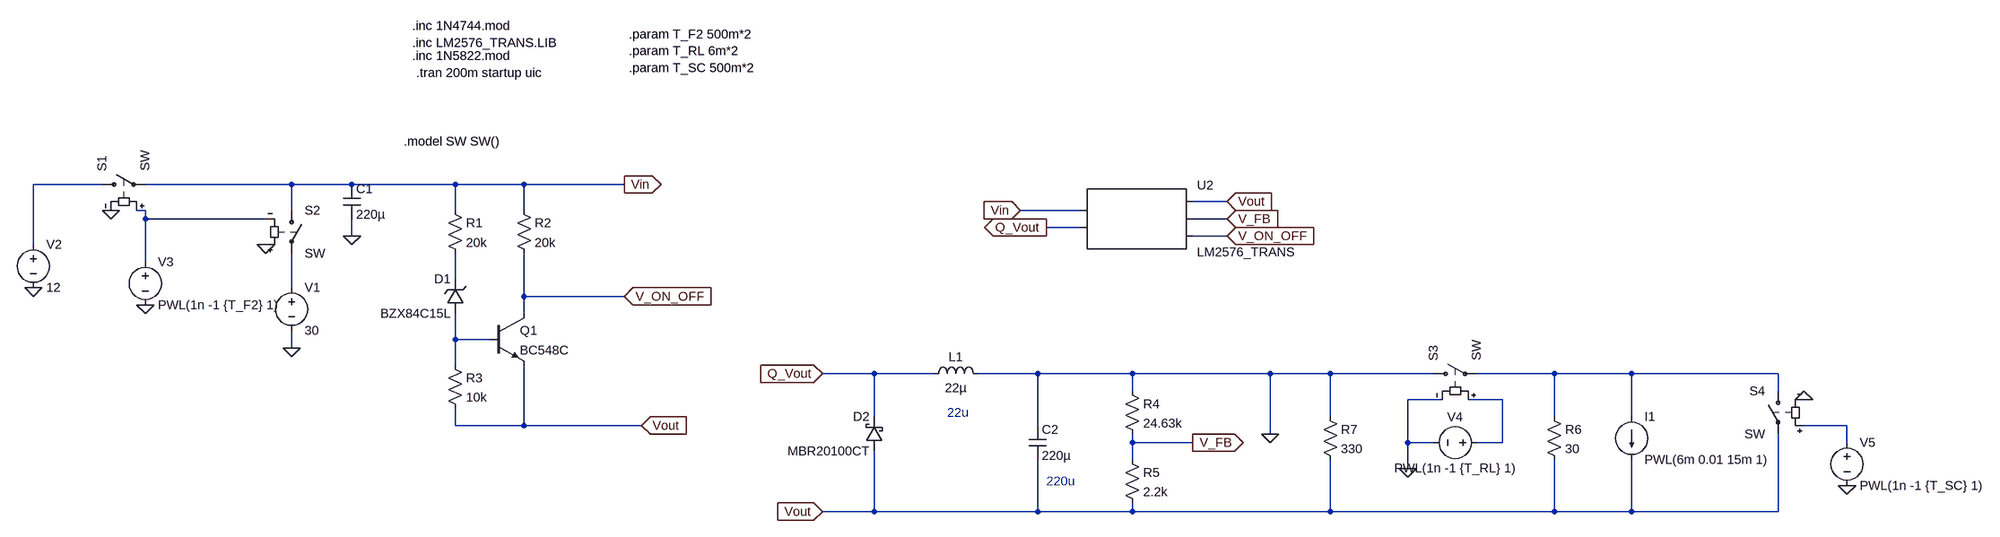
[diagram p0: schematic inverter_stepdown_LM2576.asc]
inverter_stepdown_LM2576.asc, the LTspice schematic file:
Version 4
SHEET 1 1792 680
WIRE -1760 -320 -1888 -320
WIRE -1408 -320 -1680 -320
WIRE -1296 -320 -1408 -320
WIRE -1104 -320 -1296 -320
WIRE -976 -320 -1104 -320
WIRE -768 -320 -976 -320
WIRE 352 -288 288 -288
WIRE -1680 -272 -1696 -272
WIRE -1408 -272 -1408 -320
WIRE -1104 -272 -1104 -320
WIRE -976 -272 -976 -320
WIRE 80 -272 -32 -272
WIRE -1680 -256 -1680 -272
WIRE -1456 -256 -1680 -256
WIRE 352 -256 288 -256
WIRE 80 -240 16 -240
WIRE -1296 -224 -1296 -256
WIRE 352 -224 288 -224
WIRE -1888 -208 -1888 -320
WIRE -1680 -176 -1680 -256
WIRE -1104 -144 -1104 -192
WIRE -1408 -128 -1408 -192
WIRE -976 -112 -976 -192
WIRE -768 -112 -976 -112
WIRE -976 -80 -976 -112
WIRE -1104 -32 -1104 -80
WIRE -1040 -32 -1104 -32
WIRE -1408 -16 -1408 -48
WIRE -1104 16 -1104 -32
WIRE -304 32 -400 32
WIRE -192 32 -304 32
WIRE 0 32 -112 32
WIRE 176 32 0 32
WIRE 432 32 176 32
WIRE 544 32 432 32
WIRE 736 32 544 32
WIRE 960 32 816 32
WIRE 1104 32 960 32
WIRE 1376 32 1104 32
WIRE 176 64 176 32
WIRE 1376 64 1376 32
WIRE 752 80 688 80
WIRE 864 80 800 80
WIRE -304 112 -304 32
WIRE 544 112 544 32
WIRE 960 112 960 32
WIRE 1104 112 1104 32
WIRE -1104 128 -1104 96
WIRE -976 128 -976 16
WIRE -976 128 -1104 128
WIRE -736 128 -976 128
WIRE 0 128 0 32
WIRE 1504 128 1424 128
WIRE 432 144 432 32
WIRE 176 160 176 144
WIRE 288 160 176 160
WIRE 688 160 688 80
WIRE 736 160 688 160
WIRE 864 160 864 80
WIRE 864 160 816 160
WIRE 1504 160 1504 128
WIRE 176 192 176 160
WIRE 688 208 688 160
WIRE -304 288 -304 176
WIRE -304 288 -400 288
WIRE 0 288 0 192
WIRE 0 288 -304 288
WIRE 176 288 176 272
WIRE 176 288 0 288
WIRE 544 288 544 192
WIRE 544 288 176 288
WIRE 960 288 960 192
WIRE 960 288 544 288
WIRE 1104 288 1104 192
WIRE 1104 288 960 288
WIRE 1376 288 1376 144
WIRE 1376 288 1104 288
FLAG -1408 -16 0
FLAG -768 -320 Vin
IOPIN -768 -320 Out
FLAG -1296 -224 0
FLAG -768 -112 V_ON_OFF
IOPIN -768 -112 In
FLAG -1888 -128 0
FLAG -1680 -96 0
FLAG -1744 -272 0
FLAG -1456 -208 0
FLAG -32 -272 Vin
IOPIN -32 -272 In
FLAG 16 -240 Q_Vout
IOPIN 16 -240 Out
FLAG 352 -256 V_FB
IOPIN 352 -256 In
FLAG 352 -224 V_ON_OFF
IOPIN 352 -224 In
FLAG -400 32 Q_Vout
IOPIN -400 32 In
FLAG 288 160 V_FB
IOPIN 288 160 Out
FLAG 688 208 0
FLAG 1504 240 0
FLAG 1424 80 0
FLAG -736 128 Vout
IOPIN -736 128 In
FLAG 352 -288 Vout
IOPIN 352 -288 In
FLAG -400 288 Vout
IOPIN -400 288 In
FLAG 432 144 0
SYMBOL voltage -1408 -144 R0
SYMATTR InstName V1
SYMATTR Value 30
SYMBOL cap -1312 -320 R0
SYMATTR InstName C1
SYMATTR Value 220µ
SYMBOL res -1120 -288 R0
SYMATTR InstName R1
SYMATTR Value 20k
SYMBOL res -992 -288 R0
SYMATTR InstName R2
SYMATTR Value 20k
SYMBOL res -1120 0 R0
SYMATTR InstName R3
SYMATTR Value 10k
SYMBOL npn -1040 -80 R0
SYMATTR InstName Q1
SYMATTR Value BC548C
SYMBOL zener -1088 -80 R180
WINDOW 0 24 64 Left 2
WINDOW 3 24 0 Left 2
SYMATTR InstName D1
SYMATTR Value BZX84C15L
SYMBOL sw -1776 -320 R270
SYMATTR InstName S1
SYMBOL sw -1408 -288 R0
SYMATTR InstName S2
SYMBOL voltage -1888 -224 R0
SYMATTR InstName V2
SYMATTR Value 12
SYMBOL voltage -1680 -192 R0
WINDOW 123 0 0 Left 2
WINDOW 39 0 0 Left 2
SYMATTR InstName V3
SYMATTR Value PWL(1n -1 {T_F2} 1)
SYMBOL AutoGenerated\\LM2576_TRANS 176 -256 R0
SYMATTR InstName U2
SYMBOL ind -208 48 R270
WINDOW 0 32 56 VTop 2
WINDOW 3 5 56 VBottom 2
SYMATTR InstName L1
SYMATTR Value 22µ
SYMATTR SpiceLine Ipk=10.1 Rser=0.02752 Cpar=0
SYMBOL cap -16 128 R0
SYMATTR InstName C2
SYMATTR Value 220µ
SYMBOL res 160 48 R0
SYMATTR InstName R4
SYMATTR Value 24.63k
SYMBOL res 160 176 R0
SYMATTR InstName R5
SYMATTR Value 2.2k
SYMBOL res 944 96 R0
SYMATTR InstName R6
SYMATTR Value 30
SYMBOL schottky -288 176 R180
WINDOW 0 24 64 Left 2
WINDOW 3 24 0 Left 2
SYMATTR InstName D2
SYMATTR Value MBR20100CT
SYMBOL sw 720 32 R270
SYMATTR InstName S3
SYMBOL voltage 832 160 R90
WINDOW 0 -32 56 VBottom 2
WINDOW 3 32 56 VTop 2
WINDOW 123 0 0 Left 2
WINDOW 39 0 0 Left 2
SYMATTR InstName V4
SYMATTR Value PWL(1n -1 {T_RL} 1)
SYMBOL res 528 96 R0
SYMATTR InstName R7
SYMATTR Value 330
SYMBOL sw 1376 48 M0
SYMATTR InstName S4
SYMBOL voltage 1504 144 R0
WINDOW 123 0 0 Left 2
WINDOW 39 0 0 Left 2
SYMATTR InstName V5
SYMATTR Value PWL(1n -1 {T_SC} 1)
SYMBOL current 1104 112 R0
WINDOW 123 0 0 Left 2
WINDOW 39 0 0 Left 2
SYMATTR InstName I1
SYMATTR Value PWL(6m 0.01 15m 1)
TEXT -1200 -400 Left 2 !.model SW SW()
TEXT -1184 -600 Left 2 !.inc LM2576_TRANS.LIB
TEXT -1184 -576 Left 2 !.inc 1N5822.mod
TEXT -1176 -544 Left 2 !.tran 200m startup uic
TEXT -1184 -632 Left 2 !.inc 1N4744.mod
TEXT -760 -616 Left 2 !.param T_F2 500m*2\n.param T_RL 6m*2\n.param T_SC 500m*2
TEXT -168 104 Left 2 ;22u
TEXT 16 232 Left 2 ;220u

The netlist it stands for:
* inverter_stepdown_LM2576.asc
V1 N004 0 30
C1 Vin 0 220µ
R1 Vin N003 20k
R2 Vin V_ON_OFF 20k
R3 N005 Vout 10k
Q1 V_ON_OFF N005 Vout 0 BC548C
D1 N005 N003 BZX84C15L
S1 N001 Vin N002 0 SW
S2 Vin N004 0 N002 SW
V2 N001 0 12
V3 N002 0 PWL(1n -1 {T_F2} 1)
* U2: LM2576_TRANS (symbol AutoGenerated\LM2576_TRANS not available, pins judged from their places): pin1=Vin pin2=Q_Vout pin3=Vout pin4=V_FB pin5=V_ON_OFF
L1 Q_Vout 0 22µ Ipk=10.1 Rser=0.02752 Cpar=0
C2 0 Vout 220µ
R4 0 V_FB 24.63k
R5 V_FB Vout 2.2k
R6 N006 Vout 30
D2 Vout Q_Vout MBR20100CT
S3 0 N006 N007 0 SW
V4 N007 0 PWL(1n -1 {T_RL} 1)
R7 0 Vout 330
S4 N006 Vout N008 0 SW
V5 N008 0 PWL(1n -1 {T_SC} 1)
I1 N006 Vout PWL(6m 0.01 15m 1)
.model D D
.lib standard.dio
.model NPN NPN
.model PNP PNP
.lib standard.bjt
.model SW SW()
.inc LM2576_TRANS.LIB
.inc 1N5822.mod
.tran 200m startup uic
.inc 1N4744.mod
.param T_F2 500m*2
.param T_RL 6m*2
.param T_SC 500m*2
* 22u
* 220u
.backanno
.end